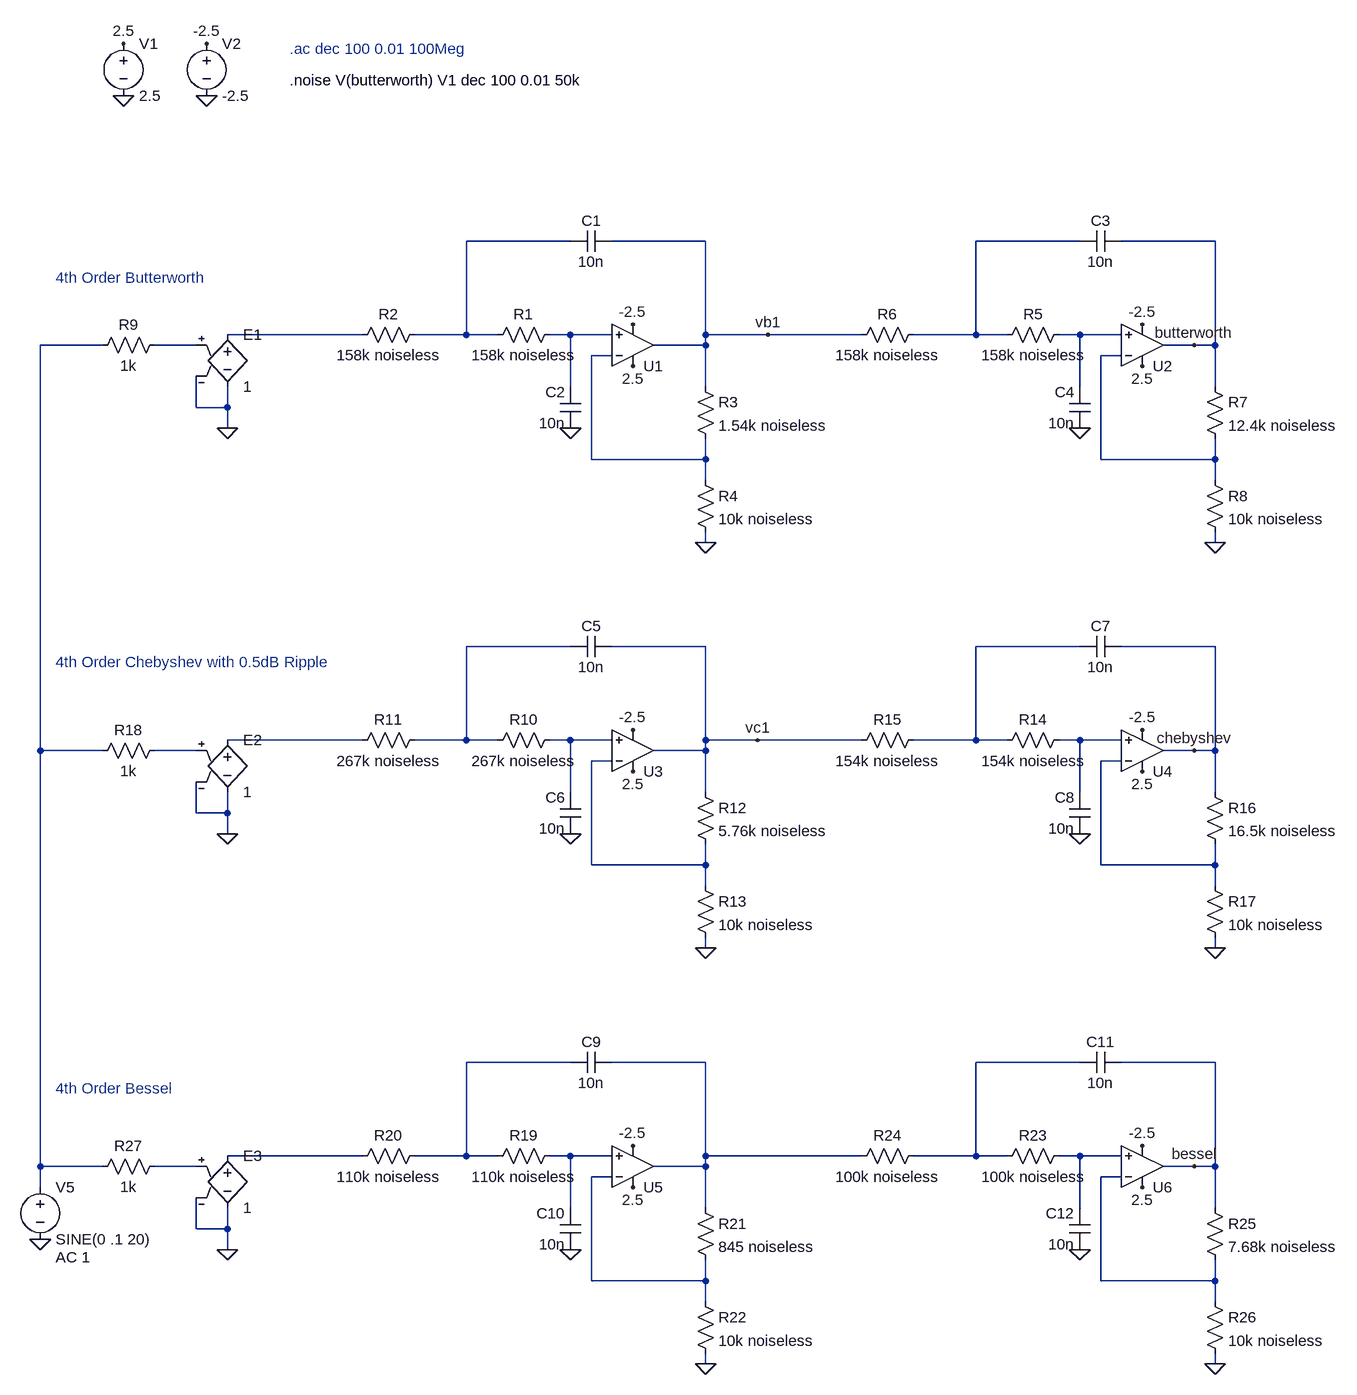
[diagram p0: schematic sallen_key_4th_order.asc]
sallen_key_4th_order.asc, the LTspice schematic file:
Version 4
SHEET 1 1576 1604
WIRE 160 -144 0 -144
WIRE 368 -144 224 -144
WIRE 944 -144 784 -144
WIRE 1152 -144 1008 -144
WIRE -160 0 -368 0
WIRE 0 0 0 -144
WIRE 0 0 -80 0
WIRE 48 0 0 0
WIRE 160 0 128 0
WIRE 224 0 160 0
WIRE 368 0 368 -144
WIRE 464 0 368 0
WIRE 608 0 464 0
WIRE 784 0 784 -144
WIRE 784 0 688 0
WIRE 832 0 784 0
WIRE 944 0 912 0
WIRE 1008 0 944 0
WIRE -560 16 -656 16
WIRE -416 16 -480 16
WIRE 368 16 368 0
WIRE 368 16 288 16
WIRE 1120 16 1072 16
WIRE 1152 16 1152 -144
WIRE 1152 16 1120 16
WIRE 224 32 192 32
WIRE 1008 32 976 32
WIRE 160 80 160 0
WIRE 368 80 368 16
WIRE 944 80 944 0
WIRE 1152 80 1152 16
WIRE -416 112 -416 64
WIRE -368 112 -368 80
WIRE -368 112 -416 112
WIRE -368 144 -368 112
WIRE 192 192 192 32
WIRE 368 192 368 160
WIRE 368 192 192 192
WIRE 976 192 976 32
WIRE 1152 192 1152 160
WIRE 1152 192 976 192
WIRE 368 224 368 192
WIRE 1152 224 1152 192
WIRE 368 320 368 304
WIRE 1152 320 1152 304
WIRE 160 480 0 480
WIRE 368 480 224 480
WIRE 944 480 784 480
WIRE 1152 480 1008 480
WIRE -160 624 -368 624
WIRE 0 624 0 480
WIRE 0 624 -80 624
WIRE 48 624 0 624
WIRE 160 624 128 624
WIRE 224 624 160 624
WIRE 368 624 368 480
WIRE 448 624 368 624
WIRE 608 624 448 624
WIRE 784 624 784 480
WIRE 784 624 688 624
WIRE 832 624 784 624
WIRE 944 624 912 624
WIRE 1008 624 944 624
WIRE -656 640 -656 16
WIRE -560 640 -656 640
WIRE -416 640 -480 640
WIRE 368 640 368 624
WIRE 368 640 288 640
WIRE 1120 640 1072 640
WIRE 1152 640 1152 480
WIRE 1152 640 1120 640
WIRE 224 656 192 656
WIRE 1008 656 976 656
WIRE 160 704 160 624
WIRE 368 704 368 640
WIRE 944 704 944 624
WIRE 1152 704 1152 640
WIRE -416 736 -416 688
WIRE -368 736 -368 704
WIRE -368 736 -416 736
WIRE -368 768 -368 736
WIRE 192 816 192 656
WIRE 368 816 368 784
WIRE 368 816 192 816
WIRE 976 816 976 656
WIRE 1152 816 1152 784
WIRE 1152 816 976 816
WIRE 368 848 368 816
WIRE 1152 848 1152 816
WIRE 368 944 368 928
WIRE 1152 944 1152 928
WIRE 160 1120 0 1120
WIRE 368 1120 224 1120
WIRE 944 1120 784 1120
WIRE 1152 1120 1008 1120
WIRE -160 1264 -368 1264
WIRE 0 1264 0 1120
WIRE 0 1264 -80 1264
WIRE 48 1264 0 1264
WIRE 160 1264 128 1264
WIRE 224 1264 160 1264
WIRE 368 1264 368 1120
WIRE 608 1264 368 1264
WIRE 784 1264 784 1120
WIRE 784 1264 688 1264
WIRE 832 1264 784 1264
WIRE 944 1264 912 1264
WIRE 1008 1264 944 1264
WIRE -656 1280 -656 640
WIRE -560 1280 -656 1280
WIRE -416 1280 -480 1280
WIRE 368 1280 368 1264
WIRE 368 1280 288 1280
WIRE 1120 1280 1072 1280
WIRE 1152 1280 1152 1120
WIRE 1152 1280 1120 1280
WIRE 224 1296 192 1296
WIRE 1008 1296 976 1296
WIRE -656 1312 -656 1280
WIRE 160 1344 160 1264
WIRE 368 1344 368 1280
WIRE 944 1344 944 1264
WIRE 1152 1344 1152 1280
WIRE -416 1376 -416 1328
WIRE -368 1376 -368 1344
WIRE -368 1376 -416 1376
WIRE -368 1408 -368 1376
WIRE 192 1456 192 1296
WIRE 368 1456 368 1424
WIRE 368 1456 192 1456
WIRE 976 1456 976 1296
WIRE 1152 1456 1152 1424
WIRE 1152 1456 976 1456
WIRE 368 1488 368 1456
WIRE 1152 1488 1152 1456
WIRE 368 1584 368 1568
WIRE 1152 1584 1152 1568
FLAG -528 -448 2.5
FLAG -400 -448 -2.5
FLAG -528 -368 0
FLAG -400 -368 0
FLAG 256 48 2.5
FLAG 256 -16 -2.5
FLAG 368 320 0
FLAG 160 144 0
FLAG 1040 48 2.5
FLAG 1040 -16 -2.5
FLAG 1152 320 0
FLAG 944 144 0
FLAG 1120 16 butterworth
FLAG -368 144 0
FLAG 256 672 2.5
FLAG 256 608 -2.5
FLAG 368 944 0
FLAG 160 768 0
FLAG 1040 672 2.5
FLAG 1040 608 -2.5
FLAG 1152 944 0
FLAG 944 768 0
FLAG 1120 640 chebyshev
FLAG -368 768 0
FLAG 256 1312 2.5
FLAG 256 1248 -2.5
FLAG 368 1584 0
FLAG 160 1408 0
FLAG -656 1392 0
FLAG 1040 1312 2.5
FLAG 1040 1248 -2.5
FLAG 1152 1584 0
FLAG 944 1408 0
FLAG 1120 1280 bessel
FLAG -368 1408 0
FLAG 448 624 vc1
FLAG 464 0 vb1
SYMBOL UniversalOpamp2 256 16 M180
SYMATTR InstName U1
SYMBOL voltage -528 -464 R0
WINDOW 123 0 0 Left 0
WINDOW 39 0 0 Left 0
SYMATTR InstName V1
SYMATTR Value 2.5
SYMBOL voltage -400 -464 R0
WINDOW 123 0 0 Left 0
WINDOW 39 0 0 Left 0
SYMATTR InstName V2
SYMATTR Value -2.5
SYMBOL res 144 -16 R90
WINDOW 0 0 56 VBottom 2
WINDOW 3 32 56 VTop 2
SYMATTR InstName R1
SYMATTR Value 158k noiseless
SYMBOL res -64 -16 R90
WINDOW 0 0 56 VBottom 2
WINDOW 3 32 56 VTop 2
SYMATTR InstName R2
SYMATTR Value 158k noiseless
SYMBOL cap 224 -160 R90
WINDOW 0 0 32 VBottom 2
WINDOW 3 32 32 VTop 2
SYMATTR InstName C1
SYMATTR Value 10n
SYMBOL cap 176 144 R180
WINDOW 0 24 56 Left 2
WINDOW 3 24 8 Left 2
SYMATTR InstName C2
SYMATTR Value 10n
SYMBOL res 352 64 R0
SYMATTR InstName R3
SYMATTR Value 1.54k noiseless
SYMBOL res 352 208 R0
SYMATTR InstName R4
SYMATTR Value 10k noiseless
SYMBOL UniversalOpamp2 1040 16 M180
SYMATTR InstName U2
SYMBOL res 928 -16 R90
WINDOW 0 0 56 VBottom 2
WINDOW 3 32 56 VTop 2
SYMATTR InstName R5
SYMATTR Value 158k noiseless
SYMBOL res 704 -16 R90
WINDOW 0 0 56 VBottom 2
WINDOW 3 32 56 VTop 2
SYMATTR InstName R6
SYMATTR Value 158k noiseless
SYMBOL cap 1008 -160 R90
WINDOW 0 0 32 VBottom 2
WINDOW 3 32 32 VTop 2
SYMATTR InstName C3
SYMATTR Value 10n
SYMBOL cap 960 144 R180
WINDOW 0 24 56 Left 2
WINDOW 3 24 8 Left 2
SYMATTR InstName C4
SYMATTR Value 10n
SYMBOL res 1136 64 R0
SYMATTR InstName R7
SYMATTR Value 12.4k noiseless
SYMBOL res 1136 208 R0
SYMATTR InstName R8
SYMATTR Value 10k noiseless
SYMBOL e -368 -16 R0
SYMATTR InstName E1
SYMATTR Value 1
SYMBOL res -464 0 R90
WINDOW 0 0 56 VBottom 2
WINDOW 3 32 56 VTop 2
SYMATTR InstName R9
SYMATTR Value 1k
SYMBOL UniversalOpamp2 256 640 M180
SYMATTR InstName U3
SYMBOL res 144 608 R90
WINDOW 0 0 56 VBottom 2
WINDOW 3 32 56 VTop 2
SYMATTR InstName R10
SYMATTR Value 267k noiseless
SYMBOL res -64 608 R90
WINDOW 0 0 56 VBottom 2
WINDOW 3 32 56 VTop 2
SYMATTR InstName R11
SYMATTR Value 267k noiseless
SYMBOL cap 224 464 R90
WINDOW 0 0 32 VBottom 2
WINDOW 3 32 32 VTop 2
SYMATTR InstName C5
SYMATTR Value 10n
SYMBOL cap 176 768 R180
WINDOW 0 24 56 Left 2
WINDOW 3 24 8 Left 2
SYMATTR InstName C6
SYMATTR Value 10n
SYMBOL res 352 688 R0
SYMATTR InstName R12
SYMATTR Value 5.76k noiseless
SYMBOL res 352 832 R0
SYMATTR InstName R13
SYMATTR Value 10k noiseless
SYMBOL UniversalOpamp2 1040 640 M180
SYMATTR InstName U4
SYMBOL res 928 608 R90
WINDOW 0 0 56 VBottom 2
WINDOW 3 32 56 VTop 2
SYMATTR InstName R14
SYMATTR Value 154k noiseless
SYMBOL res 704 608 R90
WINDOW 0 0 56 VBottom 2
WINDOW 3 32 56 VTop 2
SYMATTR InstName R15
SYMATTR Value 154k noiseless
SYMBOL cap 1008 464 R90
WINDOW 0 0 32 VBottom 2
WINDOW 3 32 32 VTop 2
SYMATTR InstName C7
SYMATTR Value 10n
SYMBOL cap 960 768 R180
WINDOW 0 24 56 Left 2
WINDOW 3 24 8 Left 2
SYMATTR InstName C8
SYMATTR Value 10n
SYMBOL res 1136 688 R0
SYMATTR InstName R16
SYMATTR Value 16.5k noiseless
SYMBOL res 1136 832 R0
SYMATTR InstName R17
SYMATTR Value 10k noiseless
SYMBOL e -368 608 R0
SYMATTR InstName E2
SYMATTR Value 1
SYMBOL res -464 624 R90
WINDOW 0 0 56 VBottom 2
WINDOW 3 32 56 VTop 2
SYMATTR InstName R18
SYMATTR Value 1k
SYMBOL UniversalOpamp2 256 1280 M180
SYMATTR InstName U5
SYMBOL res 144 1248 R90
WINDOW 0 0 56 VBottom 2
WINDOW 3 32 56 VTop 2
SYMATTR InstName R19
SYMATTR Value 110k noiseless
SYMBOL res -64 1248 R90
WINDOW 0 0 56 VBottom 2
WINDOW 3 32 56 VTop 2
SYMATTR InstName R20
SYMATTR Value 110k noiseless
SYMBOL cap 224 1104 R90
WINDOW 0 0 32 VBottom 2
WINDOW 3 32 32 VTop 2
SYMATTR InstName C9
SYMATTR Value 10n
SYMBOL cap 176 1408 R180
WINDOW 0 24 56 Left 2
WINDOW 3 24 8 Left 2
SYMATTR InstName C10
SYMATTR Value 10n
SYMBOL res 352 1328 R0
SYMATTR InstName R21
SYMATTR Value 845 noiseless
SYMBOL res 352 1472 R0
SYMATTR InstName R22
SYMATTR Value 10k noiseless
SYMBOL voltage -656 1296 R0
WINDOW 123 24 124 Left 2
WINDOW 39 0 0 Left 0
SYMATTR Value2 AC 1
SYMATTR InstName V5
SYMATTR Value SINE(0 .1 20)
SYMBOL UniversalOpamp2 1040 1280 M180
SYMATTR InstName U6
SYMBOL res 928 1248 R90
WINDOW 0 0 56 VBottom 2
WINDOW 3 32 56 VTop 2
SYMATTR InstName R23
SYMATTR Value 100k noiseless
SYMBOL res 704 1248 R90
WINDOW 0 0 56 VBottom 2
WINDOW 3 32 56 VTop 2
SYMATTR InstName R24
SYMATTR Value 100k noiseless
SYMBOL cap 1008 1104 R90
WINDOW 0 0 32 VBottom 2
WINDOW 3 32 32 VTop 2
SYMATTR InstName C11
SYMATTR Value 10n
SYMBOL cap 960 1408 R180
WINDOW 0 24 56 Left 2
WINDOW 3 24 8 Left 2
SYMATTR InstName C12
SYMATTR Value 10n
SYMBOL res 1136 1328 R0
SYMATTR InstName R25
SYMATTR Value 7.68k noiseless
SYMBOL res 1136 1472 R0
SYMATTR InstName R26
SYMATTR Value 10k noiseless
SYMBOL e -368 1248 R0
SYMATTR InstName E3
SYMATTR Value 1
SYMBOL res -464 1264 R90
WINDOW 0 0 56 VBottom 2
WINDOW 3 32 56 VTop 2
SYMATTR InstName R27
SYMATTR Value 1k
TEXT -272 -440 Left 2 ;.ac dec 100 0.01 100Meg
TEXT -272 -392 Left 2 !.noise V(butterworth) V1 dec 100 0.01 50k
TEXT -632 -88 Left 2 ;4th Order Butterworth
TEXT -632 504 Left 2 ;4th Order Chebyshev with 0.5dB Ripple
TEXT -632 1160 Left 2 ;4th Order Bessel

The netlist it stands for:
* sallen_key_4th_order.asc
XU1 N004 N008 2.5 -2.5 vb1 level.2 Avol=1Meg GBW=10Meg Slew=10Meg ilimit=25m rail=0 Vos=0 phimargin=45 en=0 enk=0 in=0 ink=0 Rin=500Meg  ; pins IN+ IN- V+ V- OUT
V1 2.5 0 2.5
V2 -2.5 0 -2.5
R1 N004 N001 158k noiseless
R2 N001 N003 158k noiseless
C1 vb1 N001 10n
C2 0 N004 10n
R3 vb1 N008 1.54k noiseless
R4 N008 0 10k noiseless
XU2 N005 N009 2.5 -2.5 butterworth level.2 Avol=1Meg GBW=10Meg Slew=10Meg ilimit=25m rail=0 Vos=0 phimargin=45 en=0 enk=0 in=0 ink=0 Rin=500Meg  ; pins IN+ IN- V+ V- OUT
R5 N005 N002 158k noiseless
R6 N002 vb1 158k noiseless
C3 butterworth N002 10n
C4 0 N005 10n
R7 butterworth N009 12.4k noiseless
R8 N009 0 10k noiseless
E1 N003 0 N007 0 1
R9 N007 N006 1k
XU3 N013 N016 2.5 -2.5 vc1 level.2 Avol=1Meg GBW=10Meg Slew=10Meg ilimit=25m rail=0 Vos=0 phimargin=45 en=0 enk=0 in=0 ink=0 Rin=500Meg  ; pins IN+ IN- V+ V- OUT
R10 N013 N010 267k noiseless
R11 N010 N012 267k noiseless
C5 vc1 N010 10n
C6 0 N013 10n
R12 vc1 N016 5.76k noiseless
R13 N016 0 10k noiseless
XU4 N014 N017 2.5 -2.5 chebyshev level.2 Avol=1Meg GBW=10Meg Slew=10Meg ilimit=25m rail=0 Vos=0 phimargin=45 en=0 enk=0 in=0 ink=0 Rin=500Meg  ; pins IN+ IN- V+ V- OUT
R14 N014 N011 154k noiseless
R15 N011 vc1 154k noiseless
C7 chebyshev N011 10n
C8 0 N014 10n
R16 chebyshev N017 16.5k noiseless
R17 N017 0 10k noiseless
E2 N012 0 N015 0 1
R18 N015 N006 1k
XU5 N022 N025 2.5 -2.5 N019 level.2 Avol=1Meg GBW=10Meg Slew=10Meg ilimit=25m rail=0 Vos=0 phimargin=45 en=0 enk=0 in=0 ink=0 Rin=500Meg  ; pins IN+ IN- V+ V- OUT
R19 N022 N018 110k noiseless
R20 N018 N021 110k noiseless
C9 N019 N018 10n
C10 0 N022 10n
R21 N019 N025 845 noiseless
R22 N025 0 10k noiseless
V5 N006 0 SINE(0 .1 20) AC 1
XU6 N023 N026 2.5 -2.5 bessel level.2 Avol=1Meg GBW=10Meg Slew=10Meg ilimit=25m rail=0 Vos=0 phimargin=45 en=0 enk=0 in=0 ink=0 Rin=500Meg  ; pins IN+ IN- V+ V- OUT
R23 N023 N020 100k noiseless
R24 N020 N019 100k noiseless
C11 bessel N020 10n
C12 0 N023 10n
R25 bessel N026 7.68k noiseless
R26 N026 0 10k noiseless
E3 N021 0 N024 0 1
R27 N024 N006 1k
* .ac dec 100 0.01 100Meg
.noise V(butterworth) V1 dec 100 0.01 50k
* 4th Order Butterworth
* 4th Order Chebyshev with 0.5dB Ripple
* 4th Order Bessel
.lib UniversalOpamps2.sub
.backanno
.end